# Altium schematic sheet PLC1_3.SchDoc
size 420 x 297 mm; SheetNumber: 3; Scale: {Масш.}; Title1str: {Наименование}; PageSetup: Record=PageOptions|CenterHorizontal=False|CenterVertical=False|PrintScale=0.67|XCorrection=0.00|YCorrection=0.00|PrintKind=1|BorderSize=5000000|LeftOffset=0|BottomOffset=0|Orientation=2|PaperLength=1000|PaperWidth=1000|Scale=100|PaperSource=7|PrintQuality=600|MediaType=1|DitherType=10|PaperKind=A4|PrintScaleMode=1; Title2str: {Наименование}; ProcessInspection: {Т.контр.}; Mass: {Масса}; NormInspection: {Н.контр.}; EngineerName: {Инженер}; Letter1Column: {}; Letter2Column: {}; Letter3Column: {}; DocumentType: ?????????????? ?????; DocumentType1str: {Документ}; DocumentType2str: {Документ}
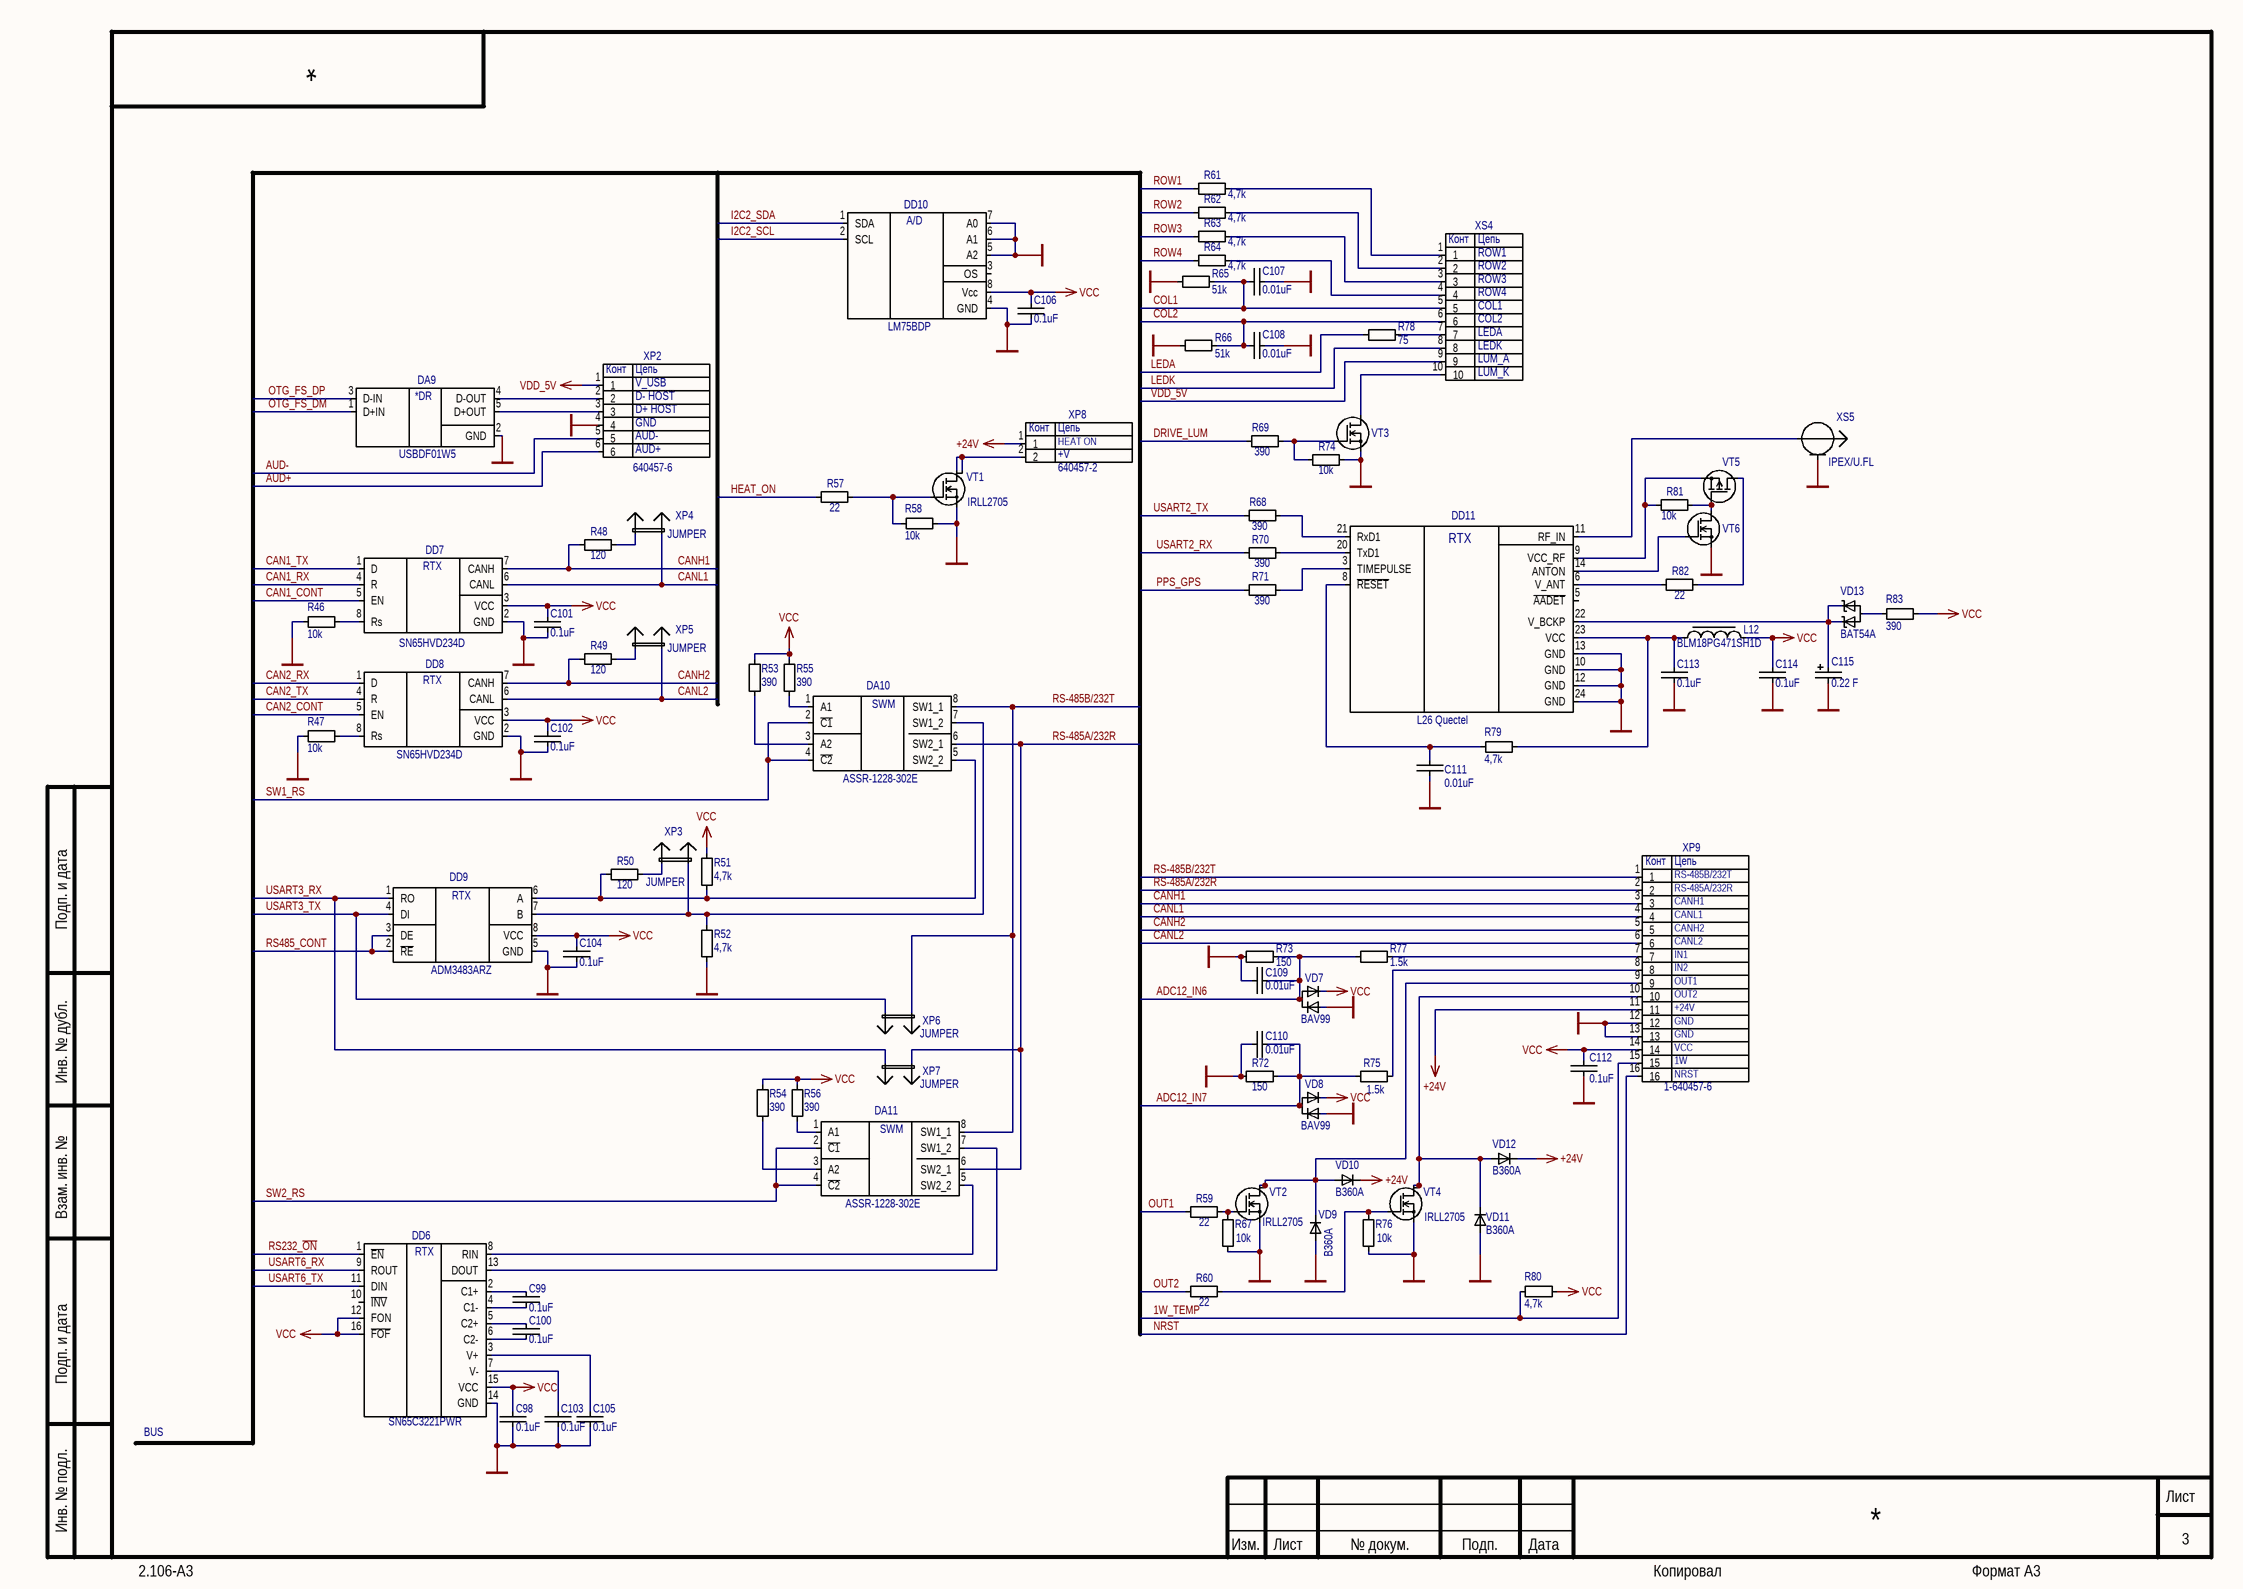
[diagram p0: PLC1_3.SchDoc]

## Parts
C98  0.1uF  [CAP_0603]
C99  0.1uF  [CAP_0603]
C100  0.1uF  [CAP_0603]
C101  0.1uF  [CAP_0603]
C102  0.1uF  [CAP_0603]
C103  0.1uF  [CAP_0603]
C104  0.1uF  [CAP_0603]
C105  0.1uF  [CAP_0603]
C106  0.1uF  [CAP_0603]
C107  0.01uF  [CAP_0603]
C108  0.01uF  [CAP_0603]
C109  0.01uF  [CAP_0603]
C110  0.01uF  [CAP_0603]
C111  0.01uF  [CAP_0603]
C112  0.1uF  [CAP_0603]
C113  0.1uF  [CAP_0603]
C114  0.1uF  [CAP_0603]
C115  0.22 F  [KR-5R5C104-R]
DA9  USBDF01W5  [SOT323-5L]
DA10  ASSR-1228-302E  [DIP8_GULL]
DA11  ASSR-1228-302E  [DIP8_GULL]
DD6  SN65C3221PWR  [TSSO5x6-G16]
DD7  SN65HVD234D  [SOIC8]
DD8  SN65HVD234D  [SOIC8]
DD9  Part Number: ADM3483ARZ  [SOIC8]  (hidden comment: ADM3483)
DD10  LM75BDP  [TSSO3x5-G8/X.4]
DD11  L26 Quectel  [VK1612U]
L12  BLM18PG471SH1D  [R_IND_0603]
R46  10k  [RES_0603]
R47  10k  [RES_0603]
R48  120  [Res_2010]
R49  120  [Res_2010]
R50  120  [Res_2010]
R51  4,7k  [RES_0603]
R52  4,7k  [RES_0603]
R53  390  [RES_0603]
R54  390  [RES_0603]
R55  390  [RES_0603]
R56  390  [RES_0603]
R57  22  [RES_0603]
R58  10k  [RES_0603]
R59  22  [RES_0603]
R60  22  [RES_0603]
R61  4,7k  [Res_0603]
R62  4,7k  [Res_0603]
R63  4,7k  [Res_0603]
R64  4,7k  [Res_0603]
R65  51k  [RES_0603]
R66  51k  [RES_0603]
R67  10k  [RES_0603]
R68  390  [RES_0603]
R69  390  [RES_0603]
R70  390  [RES_0603]
R71  390  [RES_0603]
R72  value 150  [Res_1206]  (hidden comment: Res_1206)
R73  value 150  [Res_1206]  (hidden comment: Res_1206)
R74  10k  [RES_0603]
R75  value 1.5k  [Res_1206]  (hidden comment: Res_1206)
R76  10k  [RES_0603]
R77  value 1.5k  [Res_1206]  (hidden comment: Res_1206)
R78  75  [RES_0603]
R79  4,7k  [Res_0603]
R80  4,7k  [Res_0603]
R81  10k  [RES_0603]
R82  22  [RES_0603]
R83  390  [RES_0603]
VD7  BAV99  [SOT-23]
VD8  BAV99  [SOT-23]
VD9  B360A  [DO-214AC]
VD10  B360A  [DO-214AC]
VD11  B360A  [DO-214AC]
VD12  B360A  [DO-214AC]
VD13  BAT54A  [SOT-23]
VT1  Part Number: IRLL2705  [SOT-223]  (hidden comment: N-CHAN_SOT-223)
VT2  Part Number: IRLL2705  [SOT-223]  (hidden comment: N-CHAN_SOT-223)
VT3  N-CHAN_SOT-23  [SOT-23]  (value not drawn)
VT4  Part Number: IRLL2705  [SOT-223]  (hidden comment: N-CHAN_SOT-223)
VT5  IRLML6402  [SOT-23]  (value not drawn)
VT6  N-CHAN_SOT-23  [SOT-23]  (value not drawn)
XP2  640457-6  [640457-6]
XP3  JUMPER  [PLS2-R]
XP4  JUMPER  [PLS2-R]
XP5  JUMPER  [PLS2-R]
XP6  JUMPER  [JMPTOPOLOGY]
XP7  JUMPER  [JMPTOPOLOGY]
XP8  640457-2  [640457-2]
XP9  1-640457-6  [1-640457-6]
XS4  522711079  [522711079]  (value not drawn)
XS5  IPEX/U.FL  [IPEX MHFI]

## Nets
+24V: VD10.2 VD12.2 XP8.1 XP9.11
GND: C98.2 C101.2 C102.2 C103.2 C104.2 C105.2 C106.2 C107.1 C108.1 C109.1 C110.1 C111.2 C112.2 C113.2 C114.2 C115.2 DA9.2(GND) DD6.14(GND) DD7.2(GND) DD8.2(GND) DD9.5(GND) DD10.4(GND) DD10.5(A2) DD10.6(A1) DD10.7(A0) DD11.10(GND) DD11.12(GND) DD11.13(GND) DD11.24(GND) R46.2 R47.2 R52.2 R58.1 R65.2 R66.2 R67.1 R72.2 R73.2 R74.1 R76.1 VD7.1 VD8.1 VD9.1 VD11.1 VT1.3 VT2.3 VT3.2 VT4.3 VT6.2 XP2.4 XP9.12 XP9.13 XS5.2
VCC: C98.1 C101.1 C102.1 C104.1 C106.1 C112.1 C114.1 DD6.12(FON) DD6.15(VCC) DD6.16(~{FOF}) DD7.3(VCC) DD8.3(VCC) DD9.8(VCC) DD10.8(Vcc) L12.1 R51.1 R53.1 R54.1 R55.1 R56.1 R80.1 R83.2 VD7.2 VD8.2 XP9.14
VDD_5V: XP2.1 XS4.9
1W_TEMP: R80.2 XP9.15
ADC12_IN6: C109.2 R73.1 R77.2 VD7.3
ADC12_IN7: C110.2 R72.1 R75.2 VD8.3
AUD+: XP2.6
AUD-: XP2.5
CAN1_CONT: DD7.5(EN)
CAN1_RX: DD7.4(R)
CAN1_TX: DD7.1(D)
CAN2_CONT: DD8.5(EN)
CAN2_RX: DD8.1(D)
CAN2_TX: DD8.4(R)
CANH1: DD7.7(CANH) R48.1 XP9.3
CANH2: DD8.7(CANH) R49.1 XP9.5
CANL1: DD7.6(CANL) XP4.2 XP9.4
CANL2: DD8.6(CANL) XP5.2 XP9.6
COL1: C107.2 R65.1 XS4.5
COL2: C108.2 R66.1 XS4.6
DRIVE_LUM: R69.1
HEAT_ON: R57.1
I2C2_SCL: DD10.2(SCL)
I2C2_SDA: DD10.1(SDA)
LEDA: R78.2
LEDK: XS4.8
NRST: XP9.16
OTG_FS_DM: DA9.1(D+IN)
OTG_FS_DP: DA9.3(D-IN)
OUT1: R59.1
OUT2: R60.1
PPS_GPS: R71.1
ROW1: R61.2
ROW2: R62.2
ROW3: R63.2
ROW4: R64.2
RS232_~{ON}: DD6.1(~{EN})
RS485_CONT: DD9.2(~{RE}) DD9.3(DE)
RS-485A/232R: DA10.6(SW2_1) DA11.6(SW2_1) XP7.1 XP9.2
RS-485B/232T: DA10.8(SW1_1) DA11.8(SW1_1) XP6.1 XP9.1
SW1_RS: DA10.2(~{C1}) DA10.4(~{C2})
SW2_RS: DA11.2(~{C1}) DA11.4(~{C2})
USART2_RX: R70.1
USART2_TX: R68.1
USART3_RX: DD9.1(RO) XP7.2
USART3_TX: DD9.4(DI) XP6.2
USART6_RX: DD6.9(ROUT)
USART6_TX: DD6.11(DIN)
NetC99_1: C99.1 DD6.2(C1+)
NetC99_2: C99.2 DD6.4(C1-)
NetC100_1: C100.1 DD6.5(C2+)
NetC100_2: C100.2 DD6.6(C2-)
NetC103_1: C103.1 DD6.7(V-)
NetC105_1: C105.1 DD6.3(V+)
NetC111_1: C111.1 DD11.8(~{RESET}) R79.2
NetC113_1: C113.1 DD11.23(VCC) L12.2 R79.1
NetC115_1: C115.1 DD11.22(V_BCKP) VD13.1 VD13.2
NetDA9_4: DA9.4(D-OUT) XP2.2
NetDA9_5: DA9.5(D+OUT) XP2.3
NetDA10_1: DA10.1(A1) R55.2
NetDA10_3: DA10.3(A2) R53.2
NetDA10_5: DA10.5(SW2_2) DD9.6(A) R50.1 R51.2
NetDA10_7: DA10.7(SW1_2) DD9.7(B) R52.1 XP3.2
NetDA11_1: DA11.1(A1) R56.2
NetDA11_3: DA11.3(A2) R54.2
NetDA11_5: DA11.5(SW2_2) DD6.8(RIN)
NetDA11_7: DA11.7(SW1_2) DD6.13(DOUT)
NetDD7_8: DD7.8(Rs) R46.1
NetDD8_8: DD8.8(Rs) R47.1
NetDD11_3: DD11.3(TIMEPULSE) R71.2
NetDD11_6: DD11.6(V_ANT) R82.1
NetDD11_9: DD11.9(VCC_RF) R81.2 VT5.2
NetDD11_11: DD11.11(RF_IN) XS5.1
NetDD11_14: DD11.14(ANTON) VT6.1
NetDD11_20: DD11.20(TxD1) R70.2
NetDD11_21: DD11.21(RxD1) R68.2
NetR48_2: R48.2 XP4.1
NetR49_2: R49.2 XP5.1
NetR50_2: R50.2 XP3.1
NetR57_2: R57.2 R58.2 VT1.1
NetR59_2: R59.2 R67.2 VT2.1
NetR60_2: R60.2 R76.2 VT4.1
NetR61_1: R61.1 XS4.1
NetR62_1: R62.1 XS4.2
NetR63_1: R63.1 XS4.3
NetR64_1: R64.1 XS4.4
NetR69_2: R69.2 R74.2 VT3.1
NetR75_1: R75.1 XP9.8
NetR77_1: R77.1 XP9.7
NetR78_1: R78.1 XS4.7
NetR81_1: R81.1 VT5.1 VT6.3
NetR82_2: R82.2 VT5.3
NetR83_1: R83.1 VD13.3
NetVD9_2: VD9.2 VD10.1 VT2.2 VT2.4 XP9.9
NetVD11_2: VD11.2 VD12.1 VT4.2 VT4.4 XP9.10
NetVT1_2: VT1.2 VT1.4 XP8.2
NetVT3_3: VT3.3 XS4.10

Not connected (* = marked no-connect by the designer): DD6 10(~{INV}); DD10 3(OS); DD11 5(~{AADET})

## Notes on the sheet
- (near XS4) ROW1
- (near XS4) ROW2
- (near XS4) ROW3
- (near XS4) ROW4
- (near XS4) COL1
- (near XS4) COL2
- (near XP2) Конт
- (near XP2) V_USB
- (near XP2) Цепь
- (near XS4) LEDA
- (near XS4) LEDK
- (near XS4) LUM_A
- (near XS4) LUM_K
- (near XP2) D+ HOST
- (near XP2) D- HOST
- (near XP2) GND
- (near XP2) AUD-
- (near XP2) AUD+
- (near XP8) Конт
- (near XP8) Цепь
- (near XP8) HEAT ON
- (near XP8) +V
- (near XP9) Конт
- (near XP9) Цепь
- (near XP9) RS-485B/232T
- (near XP9) RS-485A/232R
- (near XP9) CANH1
- (near XP9) CANL1
- (near XP9) CANH2
- (near XP9) CANL2
- (near XP9) IN1
- (near XP9) IN2
- (near XP9) OUT1
- (near XP9) OUT2
- (near XP9) +24V
- (near XP9) GND
- (near XP9) 1W
- (near XP9) VCC
- (near XP9) NRST
- BUS
- Подп. и дата
- Инв. № дубл.
- Взам. инв. №
- Инв. № подл.
- Изм.
- Лист
- № докум.
- Подп.
- Дата
- 2.106-A3
- Копировал
- Формат А3
- (in symbol 522711079) Конт; Цепь
- (in symbol ADM3483) RTX
- (in symbol ASSR-1228-302E) SWM
- (in symbol L26 Quectel) RTX
- (in symbol LM75BDP) A/D
- (in symbol SN65C3221PWR) RTX
- (in symbol SN65HVD234D) RTX
- (in symbol USBDF01W6) *DR

## Library data of the parts
C98-C106 C112-C114 = Cap_0603: Manufacturer: AVX; Part Number: 0603YC104KAT2A; Replacement: GRM188R71E104KA12D; PackageReference: 0603; Value: 0.1uF; Distributor: http://www.rospek.ru; Price: 0.001$
C107-C111 = Cap_0603: Manufacturer: AVX; Part Number: 0603YC103KAT2A; Replacement: GRM188R71E103KA12D; PackageReference: 0603; Value: 0.01uF; Distributor: http://www.rospek.ru; Price: 0.001$
C115 = KR-5R5C104-R: supercapacitor 0.22 uF; Manufacturer: Panasonic; Replacement: KR-5R5C224-R; Value: 0.1F; PackageReference: AXIAL 10; Part Number: KR-5R5C224-R; Distributor: panasonic.com; Price: 0.6$
DA9 = USBDF01W6: Unidirectional 2 lines Filter + ESD; Manufacturer: ST; Replacement: USBDF02W5; Price: 0.5$; Distributor: http://st.com; PackageReference: SOT-323-5; Part Number: USBDF01W5
DA10 DA11 = ASSR-1228-302E: RS-485 PHY; Manufacturer: AVAGO; Price: 2.1$; Distributor: http://www.avagotech.com; Value: ASSR-1228-302E; Replacement: ASSR-1228-302E; PackageReference: PDIP-8 GULL; Part Number: ASSR-1228-302E
DD6 = SN65C3221PWR: RS-232 PHY CAN PHY; Manufacturer: TI; Replacement: SP3221E EXAR; Price: 1.05$; Distributor: http://ti.com; PackageReference: TSSOP-16; Part Number: SN65C3221PWR
DD7 DD8 = SN65HVD234D: SN65HVD234D CAN PHY; Manufacturer: TI; Price: 1.5$; Distributor: http://ti.com; Replacement: SN65HVD234D; PackageReference: SO-8; Part Number: SN65HVD234D
DD9 = ADM3483: RS-485 PHY; Manufacturer: Analog Devices; Price: 1.1$; Distributor: http://analog.com; Replacement: ADM3483ARZ; PackageReference: SO-8 narrow
DD10 = LM75BDP: LM75BDP TEMPERATURE SENSOR; Manufacturer: NXP; Price: 0.4$; Distributor: http://nxp.com; Replacement: LM75BDP; PackageReference: TSSOP; Part Number: LM75BDP
DD11 = L26 Quectel: GPS receiver; Price: 8$; Replacement: L26 Quectel; PackageReference: LLC 24; Manufacturer: Quectel; Part Number: L26 Quectel
L12 = FCM1608KF-601T03: Manufacturer: Murata; Replacement: 600 ohm @100 MHz; PackageReference: 0603; Part Number: BLM18PG471SH1D; Distributor: http://www.chipdip.ru; Price: 0.1$; Value: BLM18PG471SH1D
R46 R47 R58 R67 R74 R76 R81 = Res_0603: 0603, 10k; Manufacturer: Vishay; Part Number: CRCW060310K0JNE; Replacement: 0603 10 kOhm 5%; PackageReference: 0603; Distributor: http://www.kontest.ru; Price: 0.01$; Value: 10k
R48-R50 = Res_2010: 2010; Manufacturer: NIC Components Corp.; Part Number: NRC50J121TRF; PackageReference: 2010; Value: 120; Price: 0.1$
R51 R52 R61-R64 R79 R80 = Res_0603: 0603, 100; Manufacturer: Vishay; Part Number: CRCW0603-472JRT1; Replacement: 0603 4.7 kOhm 5%; PackageReference: 0603; Value: 4,7k; Distributor: http://www.kontest.ru; Price: 0.01$
R53-R56 R68-R71 R83 = Res_0603: 0603, 390; Manufacturer: YAGEO; Part Number: RC0603FR-07390RL; Replacement: 0603 390 5%; PackageReference: 0603; Value: 390; Price: 0.004$
R57 R59 R60 R82 = Res_0603: 0603, 22; Manufacturer: Vishay; Part Number: CRCW020122R0JNED; Replacement: 0603 22 Ohm 5%; PackageReference: 0603; Distributor: http://www.kontest.ru; Price: 0.01$; Value: 22
R65 R66 = Res_0603: 0603, 51k; Manufacturer: Vishay; Part Number: CRCW0603-513JRT1; Replacement: 0603 51 kOhm 5%; PackageReference: 0603; Distributor: http://www.kontest.ru; Price: 0.01$
R72 R73 = Res_1206: Manufacturer: Vishay; Part Number: CRCW1206150RFKEA; Replacement: 150 Ohm 1%; PackageReference: 1206; Price: 0.1$
R75 R77 = Res_1206: Manufacturer: Vishay; Part Number: CRCW12061K50FKEA; Replacement: 1.5 kOhm 1%; PackageReference: 1206; Price: 0.1$
R78 = Res_0603: 0603; Manufacturer: YAGEO; Part Number: RC0603JR-0775RL; Replacement: 0603 75 Ohm 5%; PackageReference: 0603; Distributor: http://www.kontest.ru; Price: 0.01$; Value: 75
VD7 VD8 = BAV99: Manufacturer: Fairchild; Distributor: Fairchild; Part Number: BAV99
VD9-VD12 = S1A: Manufacturer: VISHAY; Price: 3; Distributor: http://www.chipdip.ru/; Part Number: B360A; PackageReference: DO-214AC
VT3 VT6 = N-CHAN_SOT-23: Manufacturer: IR; Part Number: IRLML2502; Replacement: IRLML2402; PackageReference: SOT-23
VT5 = P-CHAN_SOT-23: Part Number: IRLML6402
XP2 = 640457-6: Manufacturer: TE; Price: 0.19$; Part Number: 640457-6
XP3-XP5 = PLS-2 R: JUMPER 2.54; Manufacturer: TE; Part Number: PLS-2R; Distributor: www.brownbear.ru; Price: 0.05$
XP6 XP7 = TOPOLOGYJMP: JUMPER 2.54; Manufacturer: TE; Value: JMP; Price: 0.05$
XP8 = 640457-2: Manufacturer: TE; Price: 0.11; Distributor: digikey; Part Number: 640457-2
XP9 = 1-640457-6: Manufacturer: TE; Distributor: digikey; Part Number: 1-640457-6
XS4 = 522711079: Manufacturer: Molex; Price: 0.8$; Value: 522711079; Part Number: 522711079
XS5 = IPEX/U.FL: IPEX/U.FL male pcb SMT; Manufacturer: taoglas limited; Part Number: 20279-001E-01; Replacement: J983TR-ND; PackageReference: IPEX/U.FL
VD13 = BAT54A: Part Number: BAT54A
VT1 VT2 VT4 = N-CHAN_SOT-223: PackageReference: SOT-223 TO-261AA